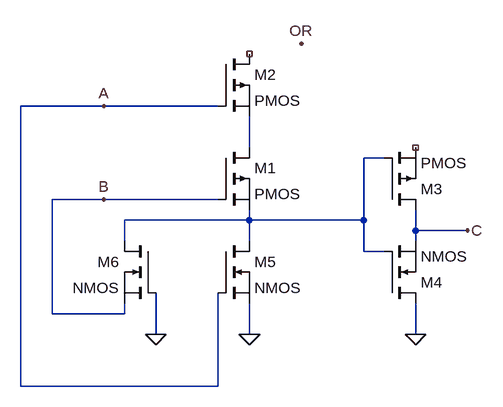
[diagram p0: schematic Draft5.asc]
Draft5.asc, the LTspice schematic file:
Version 4
SHEET 1 880 680
WIRE -32 -160 -160 -160
WIRE 144 -160 -32 -160
WIRE 192 -96 192 -144
WIRE 400 -80 368 -80
WIRE -32 -16 -112 -16
WIRE 144 -16 -32 -16
WIRE 192 16 192 0
WIRE 192 16 0 16
WIRE 368 16 368 -80
WIRE 368 16 192 16
WIRE 448 32 448 0
WIRE 528 32 448 32
WIRE 0 48 0 16
WIRE 192 48 192 16
WIRE 448 48 448 32
WIRE 368 64 368 16
WIRE 400 64 368 64
WIRE -112 160 -112 -16
WIRE 0 160 0 144
WIRE 0 160 -112 160
WIRE 48 192 48 128
WIRE 192 192 192 144
WIRE 448 192 448 144
WIRE -160 272 -160 -160
WIRE 144 272 144 128
WIRE 144 272 -160 272
FLAG 192 192 0
FLAG 48 192 0
FLAG 448 192 0
FLAG -32 -160 A
FLAG -32 -16 B
FLAG 528 32 C
FLAG 272 -256 OR
SYMBOL pmos 400 0 M180
SYMATTR InstName M3
SYMBOL nmos 400 144 M180
SYMATTR InstName M4
SYMBOL pmos 144 -96 R0
SYMATTR InstName M1
SYMBOL pmos 144 -240 R0
SYMATTR InstName M2
SYMBOL nmos 144 48 R0
SYMATTR InstName M5
SYMBOL nmos 48 48 M0
SYMATTR InstName M6

The netlist it stands for:
* Draft5.asc
M3 C N002 NC_01 NC_01 PMOS
M4 0 N002 C C NMOS
M1 N001 B N002 N002 PMOS
M2 NC_02 A N001 N001 PMOS
M5 N002 A 0 0 NMOS
M6 N002 0 B B NMOS
.model NMOS NMOS
.model PMOS PMOS
.lib standard.mos
.backanno
.end